# Altium schematic sheet Telemetry.SchDoc
size A4
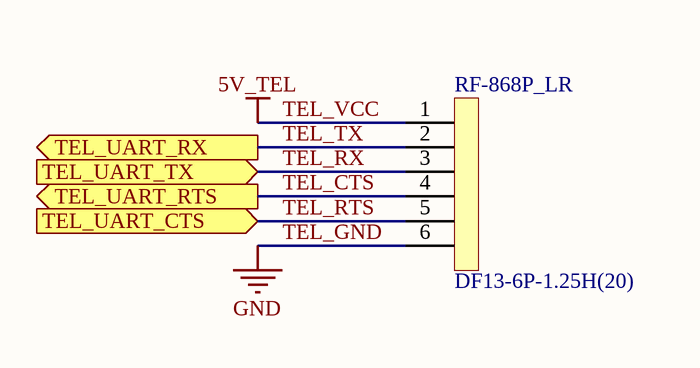
[diagram p0: Telemetry.SchDoc]

## Parts
RF-868P_LR  DF13-6P-1.25H(20)  [DF13-6P-1.25H(20)]

## Ports
TEL_UART_CTS (in), TEL_UART_RTS (out), TEL_UART_RX (out), TEL_UART_TX (in)

## Nets
TEL_GND: RF-868P_LR.6  [also labelled GND]
TEL_VCC: RF-868P_LR.1  [also labelled 5V_TEL]
TEL_CTS: RF-868P_LR.4 ; port TEL_UART_RTS
TEL_RTS: RF-868P_LR.5 ; port TEL_UART_CTS
TEL_RX: RF-868P_LR.3 ; port TEL_UART_TX
TEL_TX: RF-868P_LR.2 ; port TEL_UART_RX

## Library data of the parts
RF-868P_LR = Hirose DF13-6P-1.25H(20): Circuits: 6; Connector Orientation: Right Angle; Model: DF13-6P-1.25H(20); Mounting Style: SMT